# EAGLE design 0231-carrier-dcdc-3a (EAGLE 9.6.2)
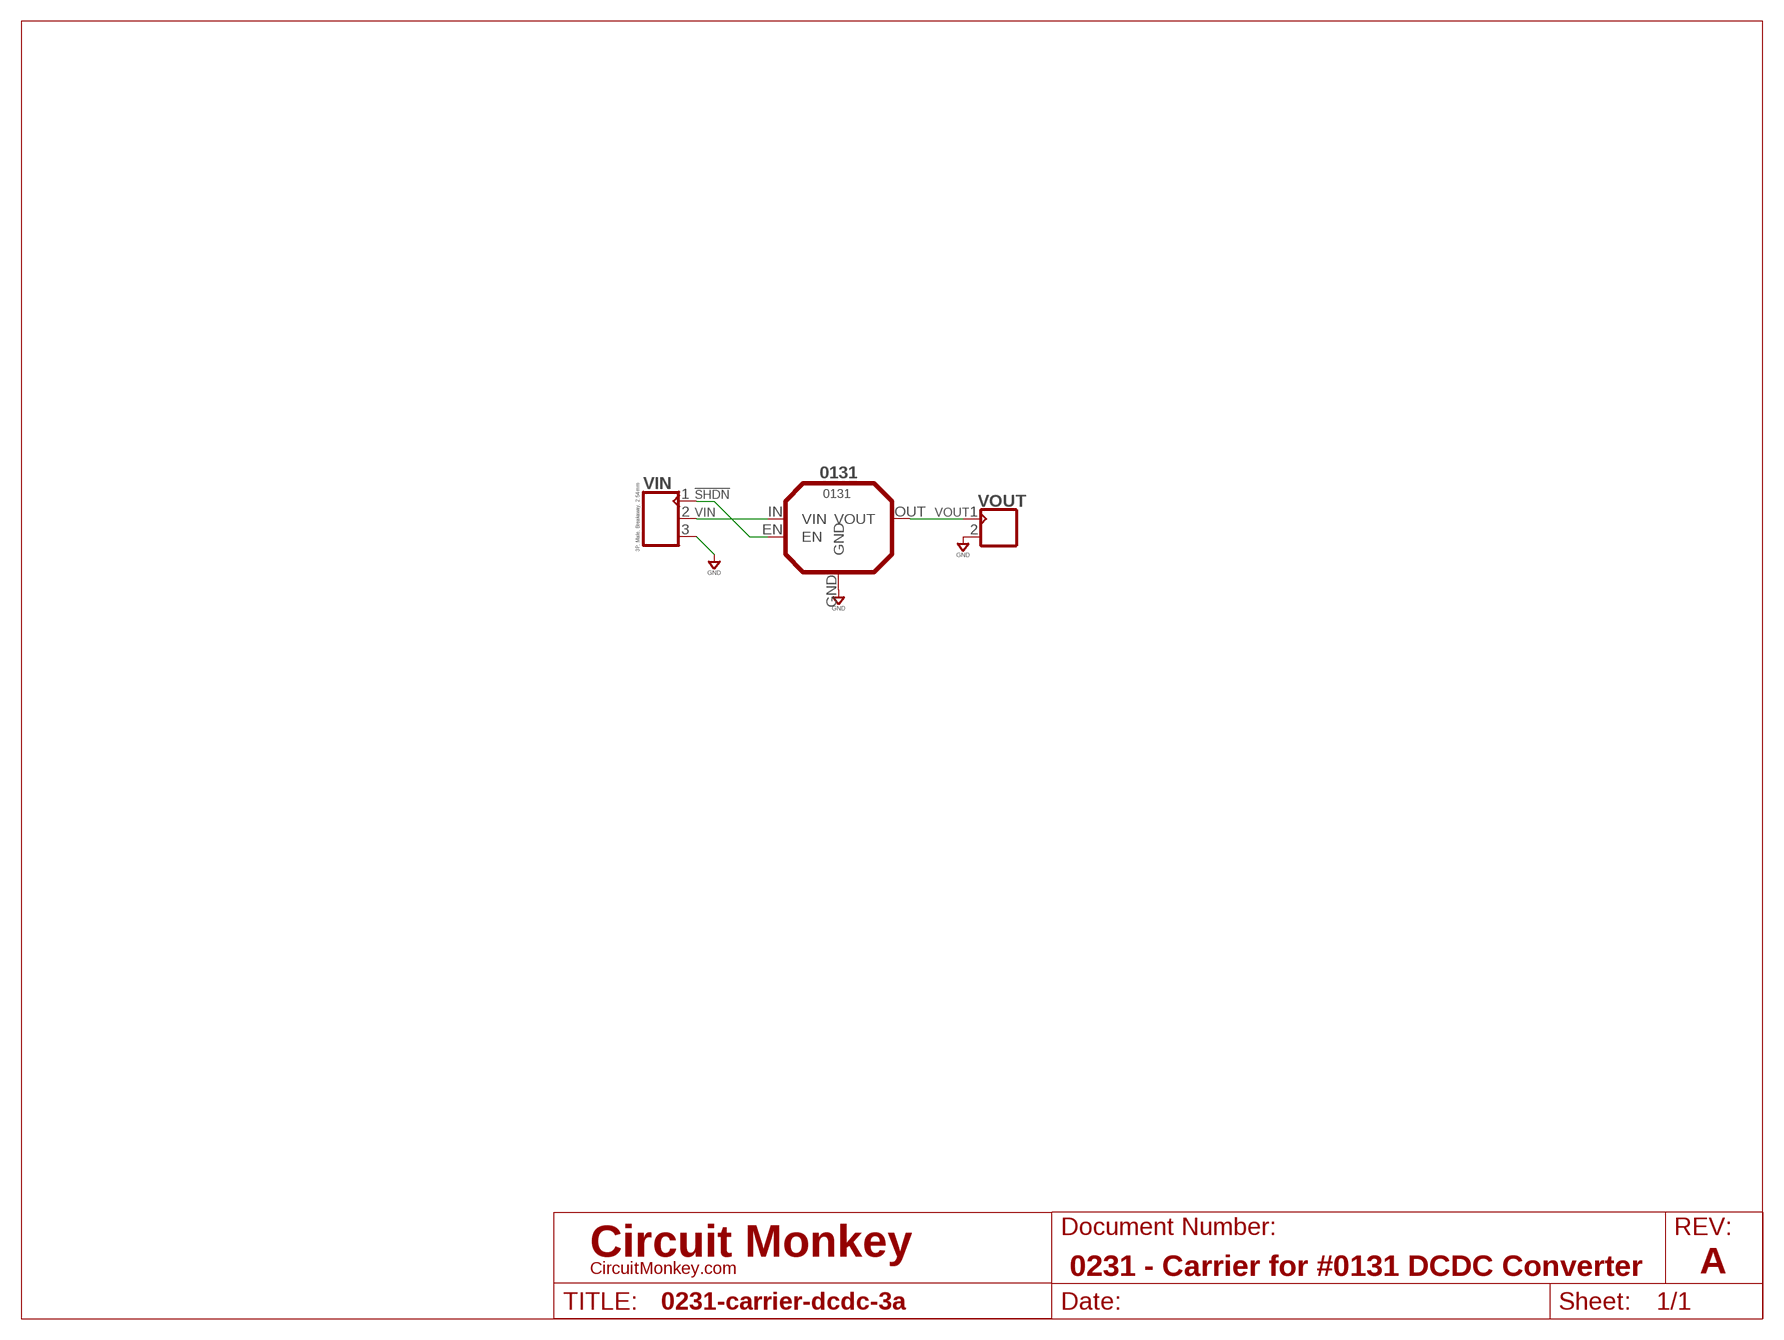
[diagram p0: schematic, sheet 1]
SHEET1 (LETTER_L-CIRCUITMONKEY): DOCUMENT_NUMBER: 0231 - Carrier for #0131 DCDC Converter; REV: A

## Parts
0131  0131  0131REV-A  [0131A]
VIN  3P, Male, Breakaway, 2.54mm  CON_03X1-2.54MM-THD-VT  [MA03X1-VT-THD]
VOUT  CON_02X1-2.54MM-THD-VT  [MA02X1-VT-THD]

## Nets
!SHDN: 0131.EN VIN.1
GND: 0131.GND VIN.3 VOUT.2
VIN: 0131.IN(VIN) VIN.2
VOUT: 0131.OUT(VOUT) VOUT.1

## Library data of the parts
0131 = circuit-monkey-chips:0131: 0131 - DCDC Converter; COST01: 12.00; COST10: 7.50; COST100: 4.50; MFR: Circuit Monkey; MPN: 0131
VIN = con-headers:CON_03X1: Header, 3-pin, single row
VOUT = con-headers:CON_02X1: Connector, 2P

## Board
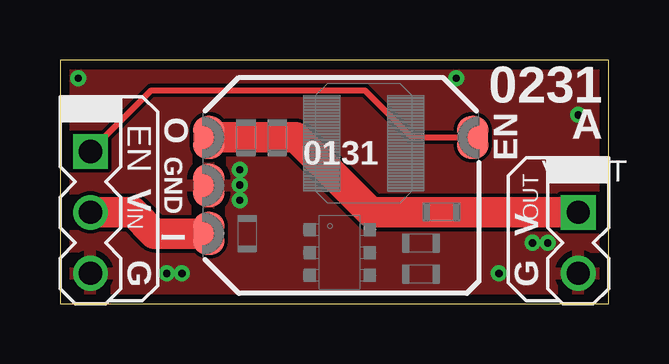
[diagram p1: board, top side]
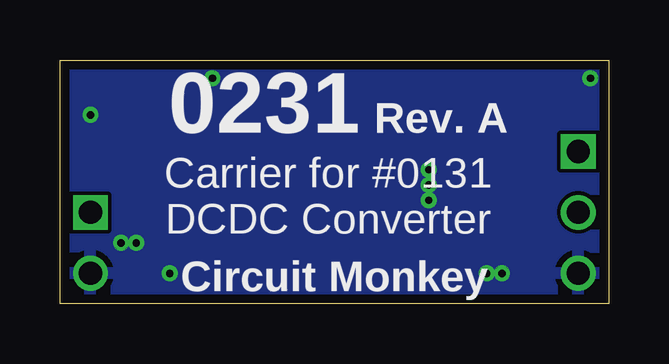
[diagram p2: board, bottom side, seen from below]

Size 22.86 x 10.16 mm. Coordinates in mm from the lower left corner, seen from the top.
Outline: 0,0 22.86,0 22.86,10.16 0,10.16 0,0
Copper layers (1*16): Top 0.0356mm / dielectric 1.5011mm / Bottom 0.0356mm
Design rules "OSH-CircuitMonkey": minimum track width 6mil, minimum drill 12mil, track to track 6mil, track to pad 6mil, pad to pad 6mil, via to via 6mil, smd to smd 6mil, copper to edge 15mil, drill to drill 6mil, minimum pad ring 7mil, minimum via ring 7mil, stop-mask expansion 3mil, vias tented up to drill 13mil, thermal gap 10mil

### Footprints (pad centres in the part's own frame; a part is rotated, then mirrored left to right if it is on the bottom)
0131A = smd 1.3 x 1.8: EN 5.5,2; GND -5.5,0; IN -5.5,-2; OUT -5.5,2
MA03X1-VT-THD = drill 0.965 square: 1 -2.54,0 | drill 0.965: 2 0,0; 3 2.54,0
MA02X1-VT-THD = drill 0.965 square: 1 -1.27,0 | drill 0.965: 2 1.27,0

### Placement (x,y rotation side)
0131  11.7,4.94 0 top
VIN  1.27,3.81 270 top
VOUT  21.59,2.54 270 top

### Tracks (layer width: path | path; a pad name or v marks a point on that pad's centre or on a via)
!SHDN
  Top 0.254: VIN.1 3.81,8.89 12.71,8.89 14.66,6.94 0131.EN
GND  (via drill 0.3)
  other vias: 7.49,4.95 7.49,5.59 7.49,4.32 0.76,9.4 4.45,1.27 5.08,1.27 18.29,1.27 20.32,2.54 19.68,2.54 21.59,7.87 16.51,9.4
  pour Top: 0,0 0,10.16 22.86,10.16 22.86,0
  pour Bottom: 22.86,0 22.86,10.16 0,10.16 0,0
VIN
  Top 1.27: VIN.2 3.05,3.81 3.94,2.92 6.18,2.92 0131.IN
VOUT
  Top 1.27: 0131.OUT 9.83,6.94 12.95,3.81 VOUT.1

### Text on the board
tPlace: 0231 | A | EN | IN | V | OUT | V | G | G
bPlace: 0231 | Rev. A | Carrier for #0131 / DCDC Converter | Circuit Monkey